# Altium schematic sheet Wifi.SchDoc
size A4
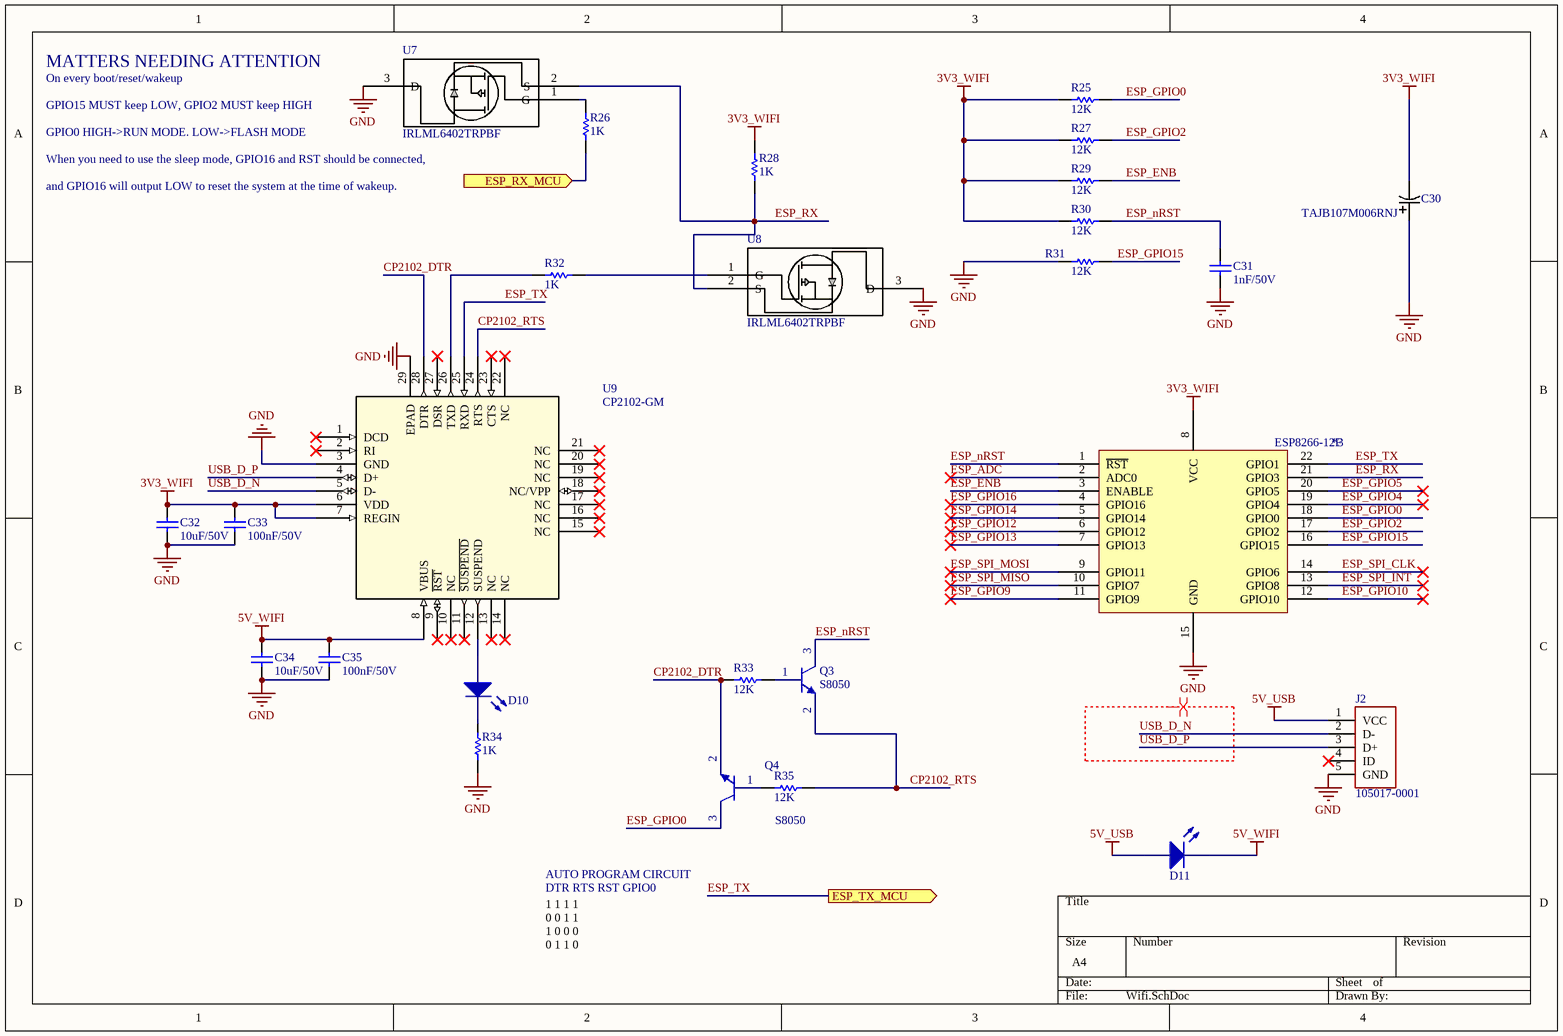
[diagram p0: Wifi.SchDoc]

## Parts
*3  ESP8266-12F  [ESP8266]
C30  TAJB107M006RNJ  [TAJB107M006RNJ]
C31  value 1nF/50V  [CAP-SM-0805]  (hidden comment: Cap-1nF-50V-0805)
C32  value 10uF/50V  [CAP-SM-0805]  (hidden comment: Cap-1nF-50V-0805)
C33  value 100nF/50V  [CAP-SM-0805]  (hidden comment: Cap-1nF-50V-0805)
C34  value 10uF/50V  [CAP-SM-0805]  (hidden comment: Cap-1nF-50V-0805)
C35  value 100nF/50V  [CAP-SM-0805]  (hidden comment: Cap-1nF-50V-0805)
D10  LED  [LED_0603_Blue]  (value not drawn)
D11  LED  [LED_0603_Blue]  (value not drawn)
J2  105017-0001  [CONN_105017-0001]
Q3  S8050  [SOT23_NEX]
Q4  S8050  [SOT23_NEX]
R25  value 12K  [RES-SM-0805]  (hidden comment: Res-0-0805)
R26  value 1K  [RES-SM-0805]  (hidden comment: Res-470-0805)
R27  value 12K  [RES-SM-0805]  (hidden comment: Res-0-0805)
R28  value 1K  [RES-SM-0805]  (hidden comment: Res-470-0805)
R29  value 12K  [RES-SM-0805]  (hidden comment: Res-0-0805)
R30  value 12K  [RES-SM-0805]  (hidden comment: Res-0-0805)
R31  value 12K  [RES-SM-0805]  (hidden comment: Res-0-0805)
R32  value 1K  [RES-SM-0805]  (hidden comment: Res-470-0805)
R33  value 12K  [RES-SM-0805]  (hidden comment: Res-0-0805)
R34  value 1K  [RES-SM-0805]  (hidden comment: Res-470-0805)
R35  value 12K  [RES-SM-0805]  (hidden comment: Res-0-0805)
U7  IRLML6402TRPBF  [IRLML6402TRPBF]
U8  IRLML6402TRPBF  [IRLML6402TRPBF]
U9  CP2102-GM  [cp2102-gm]

## Ports
ESP_RX_MCU (in), ESP_TX_MCU (out)

## Nets
3V3_WIFI: *3.8(VCC) C30.2 C32.2 C33.2 R25.1 R27.1 R28.1 R29.1 R30.1 U9.6(VDD) U9.7(REGIN)
5V_USB: D11.1(A) J2.1(VCC)
5V_WIFI: C34.2 C35.2 D11.2(K) U9.8(VBUS)
GND: *3.15(GND) C30.1 C31.1 C32.1 C33.1 C34.1 C35.1 J2.5(GND) R31.1 R34.1 U7.3(D) U8.3(D) U9.3(GND) U9.29(EPAD)
CP2102_DTR: Q4.2(E) R33.1 U9.28(DTR)
CP2102_RTS: Q3.2(E) R35.2 U9.24(RTS)
ESP_ADC: *3.2(ADC0)
ESP_ENB: *3.3(ENABLE) R29.2
ESP_GPIO0: *3.18(GPIO0) Q4.3(C) R25.2
ESP_GPIO2: *3.17(GPIO2) R27.2
ESP_GPIO4: *3.19(GPIO4)
ESP_GPIO5: *3.20(GPIO5)
ESP_GPIO9: *3.11(GPIO9)
ESP_GPIO10: *3.12(GPIO10)
ESP_GPIO12: *3.6(GPIO12)
ESP_GPIO13: *3.7(GPIO13)
ESP_GPIO14: *3.5(GPIO14)
ESP_GPIO15: *3.16(GPIO15) R31.2
ESP_GPIO16: *3.4(GPIO16)
ESP_nRST: *3.1(~{RST}) C31.2 Q3.3(C) R30.2
ESP_RX: *3.21(GPIO3) R28.2 U7.2(S) U8.2(S)
ESP_RX_MCU: R26.1 ; port ESP_RX_MCU
ESP_SPI_CLK: *3.14(GPIO6)
ESP_SPI_INT: *3.13(GPIO8)
ESP_SPI_MISO: *3.10(GPIO7)
ESP_SPI_MOSI: *3.9(GPIO11)
ESP_TX: *3.22(GPIO1) U9.25(RXD) ; port ESP_TX_MCU
USB_D_N: J2.2(D-) U9.5(D-)
USB_D_P: J2.3(D+) U9.4(D+)
NetD10_1: D10.1(A) U9.12(SUSPEND)
NetD10_2: D10.2(K) R34.2
NetQ3_1: Q3.1(B) R33.2
NetQ4_1: Q4.1(B) R35.1
NetR26_2: R26.2 U7.1(G)
NetR32_1: R32.1 U8.1(G)
NetR32_2: R32.2 U9.26(TXD)

Not connected (* = marked no-connect by the designer): J2 4(ID)*; U9 1(DCD)* 2(RI)* 9(~{RST})* 10(NC)* 11(~{SUSP}~{END})* 13(NC)* 14(NC)* 15(NC)* 16(NC)* 17(NC)* 18(NC/VPP)* 19(NC)* 20(NC)* 21(NC)* 22(NC)* 23(CTS)* 27(DSR)*

## Layout directives
differential pair: (no net found under the mark)

## Notes on the sheet
- MATTERS NEEDING ATTENTION
- On every boot/reset/wakeup
- GPIO15 MUST keep LOW, GPIO2 MUST keep HIGH
- GPIO0 HIGH->RUN MODE. LOW->FLASH MODE
- When you need to use the sleep mode, GPIO16 and RST should be connected,
- and GPIO16 will output LOW to reset the system at the time of wakeup.
- AUTO PROGRAM CIRCUIT
- DTR RTS RST GPIO0
- 1 1 1 1
  0 0 1 1
  1 0 0 0
  0 1 1 0

## Library data of the parts
*3 = ESP8266-12F: Local supply: Hshop; Local supply link: https://www.elecrow.com/download/ESP-12F.pdf
C30 = TAJB107M006RNJ: Vendor: AVX Corporation; Built_By: EMA_UL_Team; SourceLibrary: AVX_2015-1-12; Type: DEV; Manufacturer_Part_Number: TAJB107M006RNJ; Copyright: Copyright (C) 2018 Accelerated Designs. All rights reserved; RefDes: RefDes
C31-C35 = Cap-1nF-50V-0805: CAP CER 1000PF 100V X7R 0805; Manufacturer: Johanson Dielectrics Inc.; Manufacturer Part Number: 101X15W102MV4E; Local Supplier: thegioiic; Local Supplier Link: https://thegioiic.com/products/tu-1nf-50v-0805; Supplier 1: Digikey; Supplier 1 Link: https://www.digikey.com/product-detail/en/johanson-dielectrics-inc/101X15W102MV4E/709-1335-1-ND/2327235; Supplier 1 Part Number: 709-1335-1-ND
J2 = 105017-0001: No Description Available; Vendor: Molex Connector Corporation; Built_By: EMA_Cory; SourceLibrary: Molex_2020-05-26; Datasheet: https://www.molex.com/pdm_docs/sd/1050170001_sd.pdf; Manufacturer_Part_Number: 105017-0001; Copyright: Copyright (C) 2018 Accelerated Designs. All rights reserved; RefDes: RefDes; Type: DEV
R25 R27 R29-R31 R33 R35 = Res-0-0805: RES 0 OHM JUMPER 0805; Manufacturer: Vishay Dale; Manufacturer Part Number: WSL080500000ZEA9; Local Supplier: thegioiic; Local Supplier Link: https://thegioiic.com/products/dien-tro-0-ohm-0805-5; Supplier 1: Digikey; Supplier 1 Link: https://www.digikey.com/product-detail/en/vishay-dale/WSL080500000ZEA9/541-3928-1-ND/7423223; Supplier 1 Part Number: 541-3928-1-ND
R26 R28 R32 R34 = Res-470-0805: RES 470 OHM JUMPER 0805; Manufacturer: YAG6006CT-ND; Manufacturer Part Number: PE0805FRF7W0R047L; Local Supplier: thegioiic; Local Supplier Link: https://www.thegioiic.com/products/dien-tro-470-kohm-0805-5; Supplier 1: Digikey; Supplier 1 Link: https://www.digikey.com/product-detail/en/yageo/PE0805FRF7W0R047L/YAG6006CT-ND/9696460; Supplier 1 Part Number: YAG6006CT-ND
U7 U8 = IRLML6402TRPBF: No Description Available; Source_Library: Infineon_2020-02-27.xlr; Built_By: EMA_Justin; SourceLibrary: Infineon_2020-02-27; Vendor: Infineon; Copyright: Copyright (C) 2018 Accelerated Designs. All rights reserved; Manufacturer_Part_Number: IRLML6402TRPBF; RefDes: RefDes; Type: DEV
U9 = CP2102-GM: Vendor: Silicon Labs; Built_By: EMA_UL_Team; SourceLibrary: Silicon_Labs_2015-03-23; Manufacturer_Part_Number: CP2102-GM; Copyright: Copyright (C) 2018 Accelerated Designs. All rights reserved; RefDes: RefDes; Type: DEV